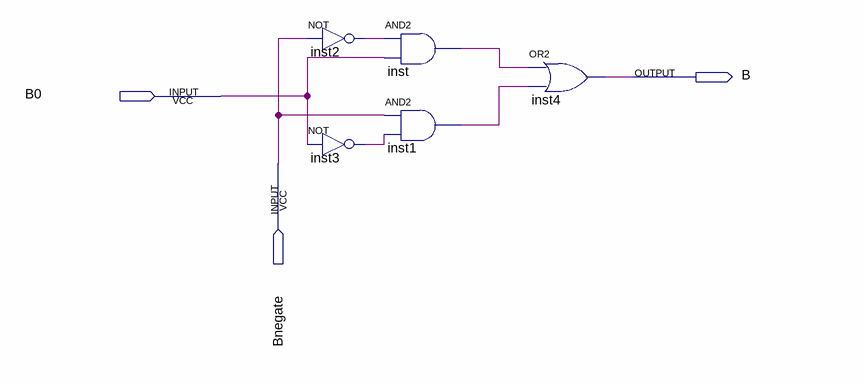
[diagram p0: schematic sheet]
// Quartus schematic Mux_2x1.bdf as structural Verilog: 5 symbols, 3 pins
module Mux_2x1 (
  input  B0,
  input  Bnegate,
  output B
);

  wire inst1_out, inst2_out, inst3_out, inst_out;

  not inst2 (inst2_out, Bnegate);
  not inst3 (inst3_out, B0);
  and inst (inst_out, inst2_out, B0);
  and inst1 (inst1_out, Bnegate, inst3_out);
  or inst4 (B, inst_out, inst1_out);
endmodule
